# Altium schematic sheet USB.SchDoc: Bison-Board
size A4; DrawnBy: mzy2364; Revision: V1.4
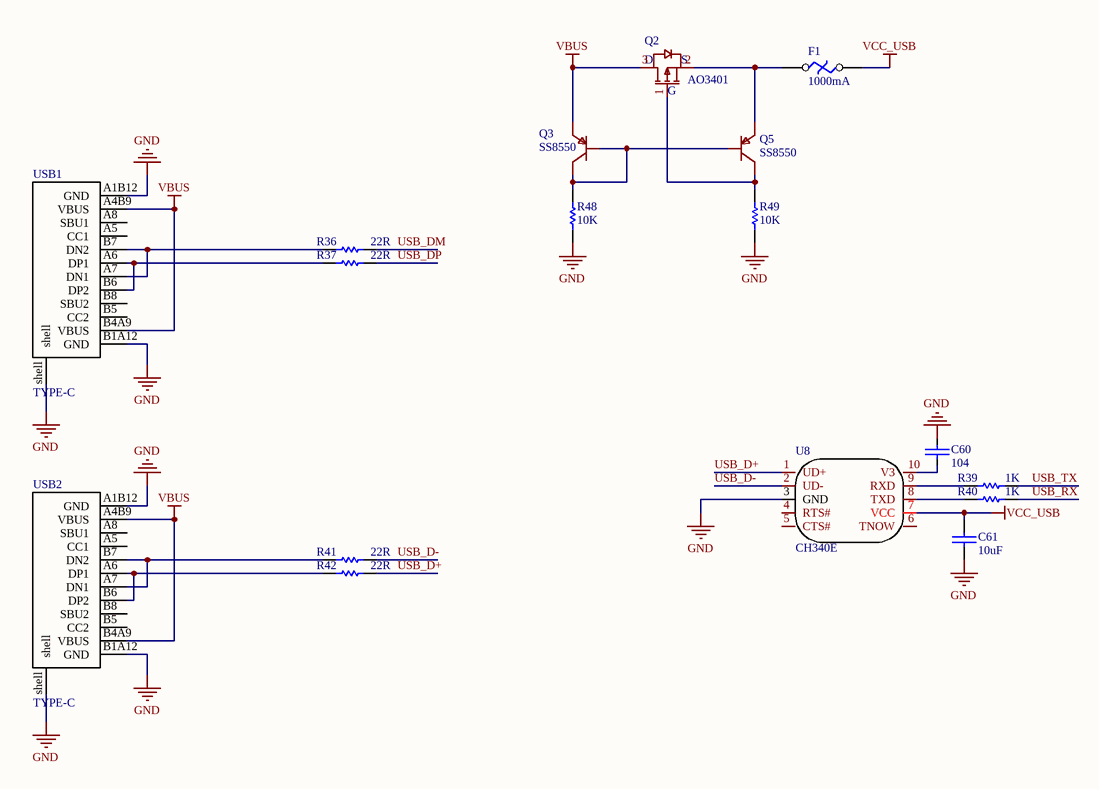
[diagram p0: USB.SchDoc]

## Parts
C60  104  [C 0603]
C61  10uF  [C 0603]
F1  1000mA  [F 0805]
Q2  AO3401  [SOT-23]
Q3  SS8550  [SOT-23]
Q5  SS8550  [SOT-23]
R36  22R  [R 0603]
R37  22R  [R 0603]
R39  1K  [R 0603]
R40  1K  [R 0603]
R41  22R  [R 0603]
R42  22R  [R 0603]
R48  10K  [R 0603]
R49  10K  [R 0603]
U8  CH340E  [MSOP-10]
USB1  TYPE-C  [USB-TYPE-C]
USB2  TYPE-C  [USB-TYPE-C]

## Nets
GND: C60.1 C61.2 R48.1 R49.1 U8.3(GND) USB1.A1B12(GND) USB1.B1A12(GND) USB1.shell USB2.A1B12(GND) USB2.B1A12(GND) USB2.shell
VBUS: Q2.3(D) Q3.2(E) USB1.A4B9(VBUS) USB1.B4A9(VBUS) USB2.A4B9(VBUS) USB2.B4A9(VBUS)
VCC_USB: C61.1 F1.2 U8.7(VCC)
USB_D+: R42.2 U8.1(UD+)
USB_D-: R41.2 U8.2(UD-)
USB_DM: R36.2
USB_DP: R37.2
USB_RX: R40.2
USB_TX: R39.2
NetC60_2: C60.2 U8.10(V3)
NetF1_1: F1.1 Q2.2(S) Q5.2(E)
NetQ2_1: Q2.1(G) Q5.3(C) R49.2
NetQ3_1: Q3.1(B) Q3.3(C) Q5.1(B) R48.2
NetR36_1: R36.1 USB1.A7(DN1) USB1.B7(DN2)
NetR37_1: R37.1 USB1.A6(DP1) USB1.B6(DP2)
NetR39_1: R39.1 U8.9(RXD)
NetR40_1: R40.1 U8.8(TXD)
NetR41_1: R41.1 USB2.A7(DN1) USB2.B7(DN2)
NetR42_1: R42.1 USB2.A6(DP1) USB2.B6(DP2)

Not connected (* = marked no-connect by the designer): U8 4(RTS#) 5(CTS#) 6(TNOW); USB1 A5(CC1) A8(SBU1) B5(CC2) B8(SBU2); USB2 A5(CC1) A8(SBU1) B5(CC2) B8(SBU2)

## Library data of the parts
C60 C61 = CAP: Capacitor
F1 = F: 熔断开关
Q2 = PMOS
Q3 Q5 = PNP
R36 R37 R39-R42 R48 R49 = RES
USB1 USB2 = USB TYPE-C: TYPE-C 16pin